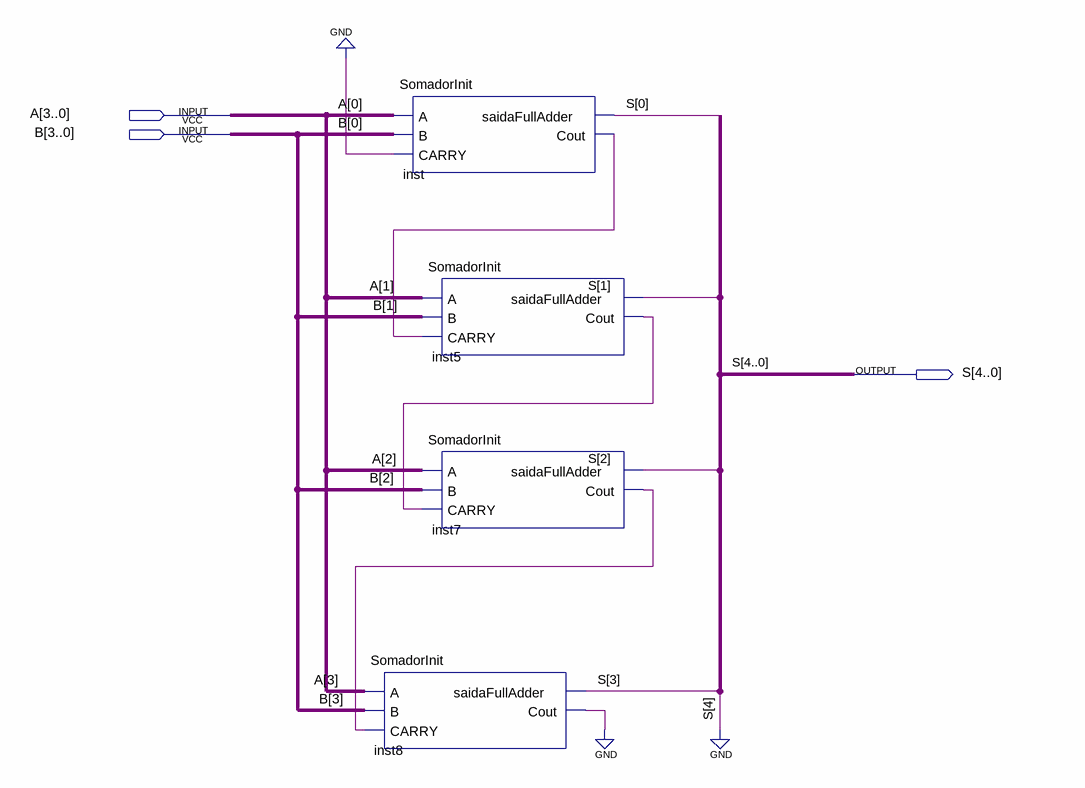
[diagram p0: schematic sheet]
// Quartus schematic somador_sem_carryout.bdf as structural Verilog: 4 symbols, 3 pins
module somador_sem_carryout (
  input  [3:0] A,
  input  [3:0] B,
  output [4:0] S
);

  wire inst5_cout, inst7_cout, inst8_cout, inst_cout;

  SomadorInit inst (.A(A[0]), .B(B[0]), .CARRY(1'b0), .saidaFullAdder(S[0]), .Cout(inst_cout));
  SomadorInit inst8 (.A(A[3]), .B(B[3]), .CARRY(inst7_cout), .saidaFullAdder(S[3]), .Cout(inst8_cout));
  SomadorInit inst5 (.A(A[1]), .B(B[1]), .CARRY(inst_cout), .saidaFullAdder(S[1]), .Cout(inst5_cout));
  SomadorInit inst7 (.A(A[2]), .B(B[2]), .CARRY(inst5_cout), .saidaFullAdder(S[2]), .Cout(inst7_cout));

  assign S[4] = 1'b0;
  // also tied to GND on the sheet: inst8_cout
endmodule
